# EAGLE design Beta (EAGLE 9.6.2)
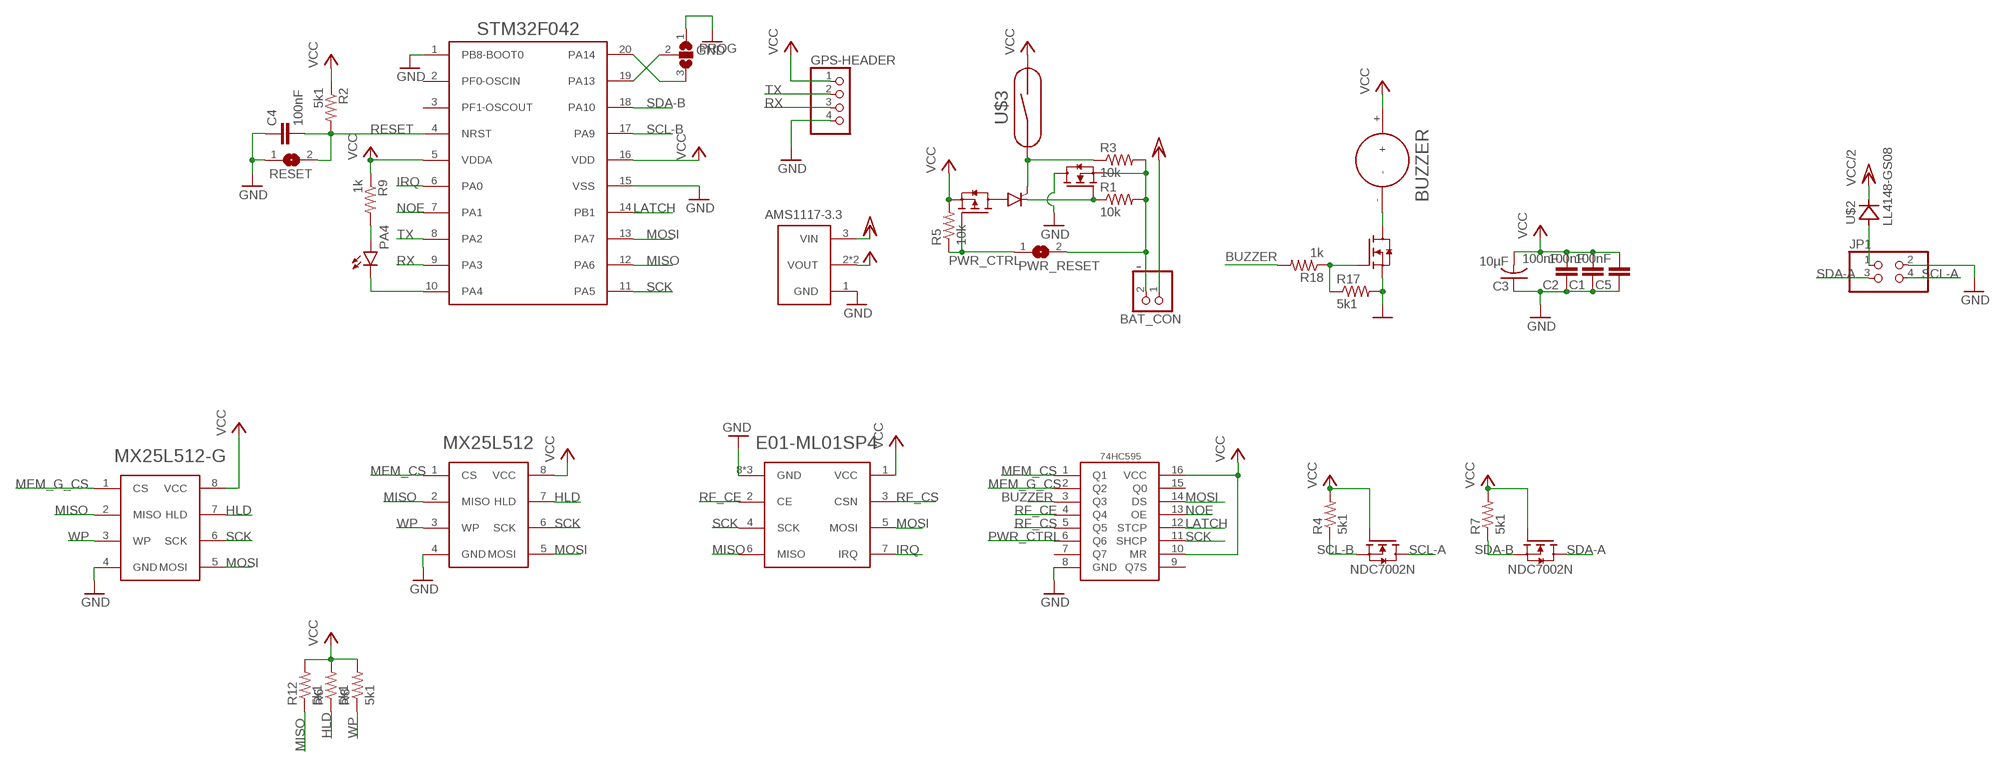
[diagram p0: schematic, sheet 1]

## Parts
74HC595  74HC595SOIC16  [SOIC16]
AMS1117-3.3  AMS1117  [SOT223]
AO3407  AO3407A  [SOT23-3]
BAT_CON  PINHD-1X2  [1X02]
BUZ  SI2302CDS  [SOT23-3]
BUZZER  BUZZER-5V  [BUZZER]
C1  100nF  C-EUC0603  [C0603]
C2  100nF  C-EUC0603  [C0603]
C3  10µF  C-USC1206  [C1206]
C4  100nF  C-EUC0603  [C0603]
C5  100nF  C-EUC0603  [C0603]
E01-ML01SP4  E01-ML01SP4  [E01-ML01SP4]
GPS-HEADER  PINHD-1X4  [1X04]
JP1  PINHD-2X2  [2X02]
MX25L512  MX25L25645  [SOP8]
MX25L512-G  MX25L25645  [SOP8]
NDC7002N  NDC7002N  [SOT-23-6]
P0102BL  P0102BL  [SOT23-3]
PA4  LEDCHIPLED_0603  [CHIPLED_0603]
PROG  SJ2W  [SJ_2]
PWR_RESET  SJ  [SJ]
R1  10k  R-US_R0603  [R0603]
R2  5k1  R-US_R0603  [R0603]
R3  10k  R-US_R0603  [R0603]
R4  5k1  R-US_R0603  [R0603]
R5  10k  R-US_R0603  [R0603]
R6  5k1  R-US_R0603  [R0603]
R7  5k1  R-US_R0603  [R0603]
R8  5k1  R-US_R0603  [R0603]
R9  1k  R-US_R0603  [R0603]
R12  5k1  R-US_R0603  [R0603]
R17  5k1  R-US_R0603  [R0603]
R18  1k  R-US_R0603  [R0603]
RESET  SJ  [SJ]
SI2302  SI2302CDS  [SOT23-3]
STM32F042  STM32F042F6P6  [TSSOP-20]
U$2  LL4148-GS08  [SOD-80]
U$3  МКА-07101  [МКА-07101]

## Nets
BUZZER: 74HC595.3(Q3) R18.2
GND: 74HC595.8(GND) AMS1117-3.3.1(GND) BUZ.2(S) C1.1 C2.1 C3.1 C4.1 C5.1 E01-ML01SP4.8(GND) E01-ML01SP4.9(GND) E01-ML01SP4.10(GND) GPS-HEADER.4 JP1.2 MX25L512-G.4(GND) MX25L512.4(GND) PROG.1 R17.2 RESET.1 SI2302.3(D) STM32F042.1(PB8-BOOT0) STM32F042.15(VSS)
GND1: PA4.C STM32F042.10(PA4)
HLD: MX25L512-G.7(HLD) MX25L512.7(HLD) R6.1
IRQ: E01-ML01SP4.7(IRQ) STM32F042.6(PA0)
LATCH: 74HC595.12(STCP) STM32F042.14(PB1)
MEM_CS: 74HC595.1(Q1) MX25L512.1(CS)
MEM_G_CS: 74HC595.2(Q2) MX25L512-G.1(CS)
MISO: E01-ML01SP4.6(MISO) MX25L512-G.2(MISO) MX25L512.2(MISO) R12.1 STM32F042.12(PA6)
MOSI: 74HC595.14(DS) E01-ML01SP4.5(MOSI) MX25L512-G.5(MOSI) MX25L512.5(MOSI) STM32F042.13(PA7)
N$1: BUZ.3(D) BUZZER.-
N$2: PROG.2 STM32F042.19(PA13)
N$3: PROG.3 STM32F042.20(PA14)
N$4: P0102BL.1(C) R1.1 SI2302.1(G)
N$5: PA4.A R9.2
N$6: P0102BL.2(G) R3.1 U$3.1
N$7: AO3407.3(D) P0102BL.3(A)
N$8: BAT_CON.2 PWR_RESET.2 R1.2 R3.2 SI2302.2(S)
N$9: BUZ.1(G) R17.1 R18.1
N$16: JP1.1 U$2.1(A)
NOE: 74HC595.13(OE) STM32F042.7(PA1)
PWR_CTRL: 74HC595.6(Q6) AO3407.1(G) PWR_RESET.1 R5.1
RESET: C4.2 R2.2 RESET.2 STM32F042.4(NRST)
RF_CE: 74HC595.4(Q4) E01-ML01SP4.2(CE)
RF_CS: 74HC595.5(Q5) E01-ML01SP4.3(CSN)
RX: GPS-HEADER.3 STM32F042.9(PA3)
SCK: 74HC595.11(SHCP) E01-ML01SP4.4(SCK) MX25L512-G.6(SCK) MX25L512.6(SCK) STM32F042.11(PA5)
SCL-A: JP1.4 NDC7002N.6(D1)
SCL-B: NDC7002N.5(S1) R4.1 STM32F042.17(PA9)
SDA-A: JP1.3 NDC7002N.4(D2)
SDA-B: NDC7002N.2(S2) R7.1 STM32F042.18(PA10)
TX: GPS-HEADER.2 STM32F042.8(PA2)
VCC: 74HC595.10(MR) 74HC595.16(VCC) AMS1117-3.3.2(VOUT) AMS1117-3.3.4(VOUT) AO3407.2(S) BUZZER.+ C1.2 C2.2 C3.2 C5.2 E01-ML01SP4.1(VCC) GPS-HEADER.1 MX25L512-G.8(VCC) MX25L512.8(VCC) NDC7002N.1(G1) NDC7002N.3(G2) R2.1 R4.2 R5.2 R6.2 R7.2 R8.2 R9.1 R12.2 STM32F042.5(VDDA) STM32F042.16(VDD) U$3.2
VCC/2: AMS1117-3.3.3(VIN) BAT_CON.1 U$2.2(C)
WP: MX25L512-G.3(WP) MX25L512.3(WP) R8.1
Unconnected: 74HC595.7(Q7) 74HC595.9(Q7S) 74HC595.15(Q0) STM32F042.2(PF0-OSCIN) STM32F042.3(PF1-OSCOUT)

## Notes on the sheet
- -

## Library data of the parts
74HC595 = CanCubeSat:74HC595
AMS1117-3.3 = Kunosheru:AMS1117
AO3407 = CanCubeSat:AO3407A
BAT_CON = pinhead:PINHD-1X2: PIN HEADER
BUZ SI2302 = CanCubeSat:SI2302CDS
BUZZER = CanCubeSat:BUZZER-5V
C1 C2 C4 C5 = rcl:C-EU: CAPACITOR, European symbol; SPICEPREFIX: C
C3 = rcl:C-US: CAPACITOR, American symbol; SPICEPREFIX: C
E01-ML01SP4 = CanCubeSat:E01-ML01SP4
GPS-HEADER = HM:PINHD-1X4: PIN HEADER
JP1 = pinhead:PINHD-2X2: PIN HEADER
MX25L512 MX25L512-G = HM:MX25L25645
NDC7002N = HM:NDC7002N
P0102BL = Kunosheru:P0102BL
PA4 = led:LED: LED OSRAM: - CHIPLED LG R971, LG N971, LY N971, LG Q971, LY Q971, LO R971, LY R971 LH N974, LH R974 LS Q976, LO Q976, LY Q976 LO Q996 - Hyper CHIPLED LW Q18S LB Q993, LB Q99A, LB R99A - SideLED LS A670, LO A670, LY A670, LG A670, LP A670 LB A673, LV A673, LT A673, LW A673 LH A674 LY A675 LS A676, LA A676, LO A676, LY A676, LW A676 LS A679, LY A679, LG A679 - Hyper Micro SIDELED® LS Y876, LA Y876, LO Y876, LY Y876 LT Y87S - SmartLED LW L88C, LW L88S LB L89C, LB L89S, LG L890 LS L89K, LO L89K, LY L89K LS L896, LA L896, LO L896, LY L896 - TOPLED LS T670, LO T670, LY T670, LG T670, LP T670 LSG T670, LSP T670, LSY T670, LOP T670, LYG T670 LG T671, LOG T671, LSG T671 LB T673, LV T673, LT T673, LW T673 LH T674 LS T676, LA T676, LO T676, LY T676, LB T676, LH T676, LSB T676, LW T676 LB T67C, LV T67C, LT T67C, LS T67K, LO T67K, LY T67K, LW E67C LS E67B, LA E67B, LO E67B, LY E67B, LB E67C, LV E67C, LT E67C LW T67C LS T679, LY T679, LG T679 LS T770, LO T770, LY T770, LG T770, LP T770 LB T773, LV T773, LT T773, LW T773 LH T774 LS E675, LA E675, LY E675, LS T675 LS T776, LA T776, LO T776, LY T776, LB T776 LHGB T686 LT T68C, LB T68C - Hyper Mini TOPLED® LB M676 - Mini TOPLED Santana® LG M470 LS M47K, LO M47K, LY M47K Source: http://www.osram.convergy.de LUXEON: - LUMILED® LXK2-PW12-R00, LXK2-PW12-S00, LXK2-PW14-U00, LXK2-PW14-V00 LXK2-PM12-R00, LXK2-PM12-S00, LXK2-PM14-U00 LXK2-PE12-Q00, LXK2-PE12-R00, LXK2-PE12-S00, LXK2-PE14-T00, LXK2-PE14-U00 LXK2-PB12-K00, LXK2-PB12-L00, LXK2-PB12-M00, LXK2-PB14-N00, LXK2-PB14-P00, LXK2-PB14-Q00 LXK2-PR12-L00, LXK2-PR12-M00, LXK2-PR14-Q00, LXK2-PR14-R00 LXK2-PD12-Q00, LXK2-PD12-R00, LXK2-PD12-S00 LXK2-PH12-R00, LXK2-PH12-S00 LXK2-PL12-P00, LXK2-PL12-Q00, LXK2-PL12-R00 Source: www.luxeon.com KINGBRIGHT: KA-3528ASYC Source: www.kingbright.com
PROG = jumper:SJ2W: SMD solder JUMPER
PWR_RESET RESET = jumper:SJ: SMD solder JUMPER
R1-R9 R12 R17 R18 = rcl:R-US_: RESISTOR, American symbol; SPICEPREFIX: R
STM32F042 = Kunosheru:STM32F042F6P6
U$2 = CanCubeSat:LL4148-GS08
U$3 = Kunosheru:МКА-07101

## Board
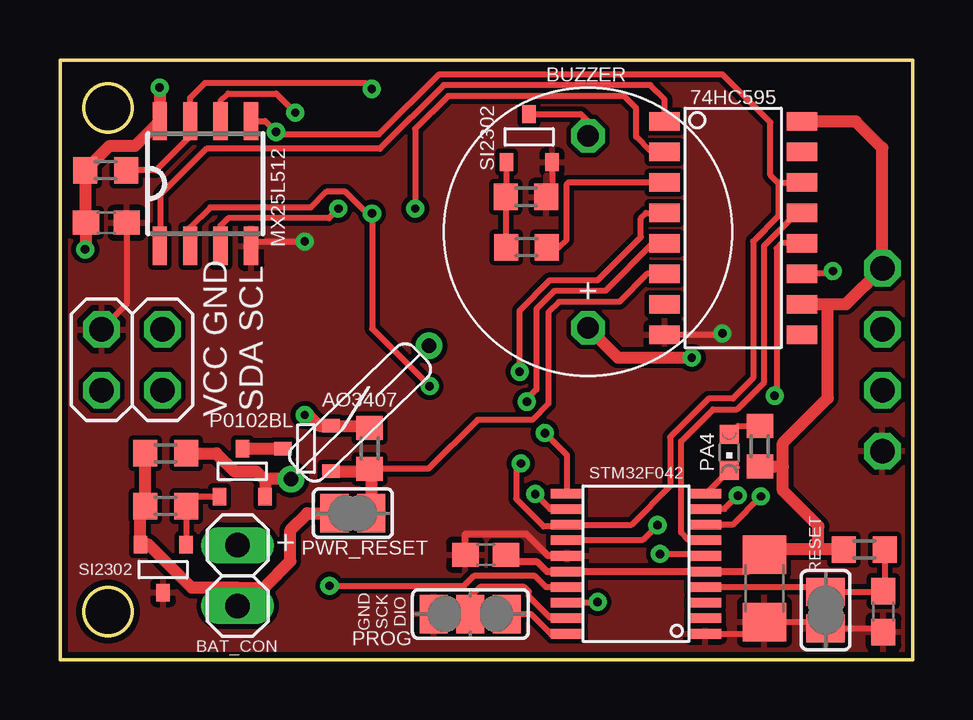
[diagram p1: board, top side]
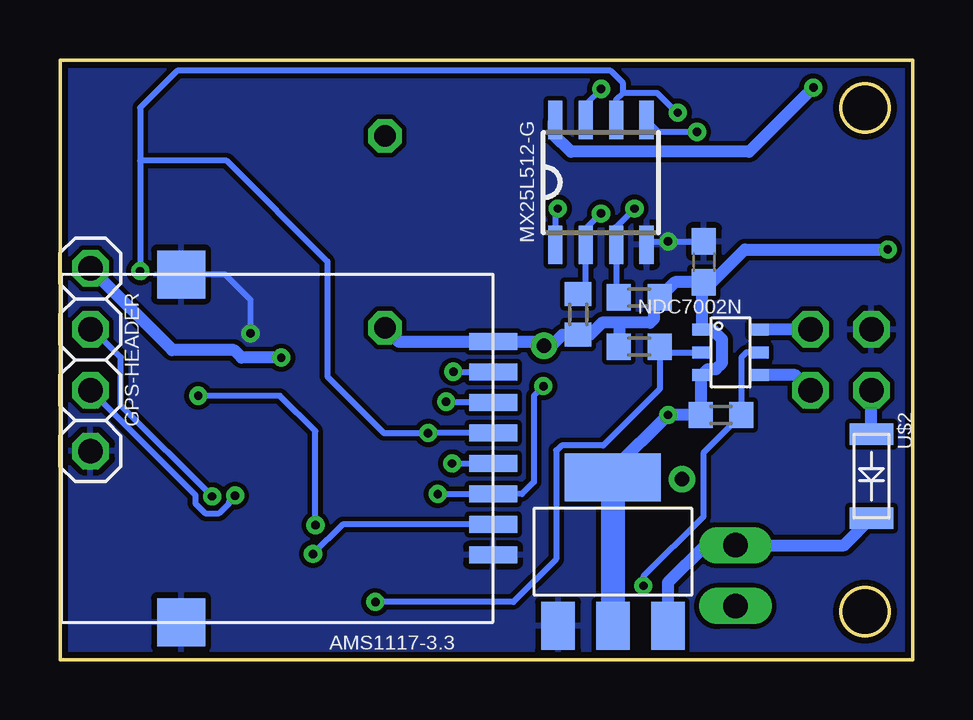
[diagram p2: board, bottom side, seen from below]

Size 35.54 x 25 mm. Coordinates in mm from the lower left corner, seen from the top.
Outline: 0,0 35.54,0 35.54,25 0,25 0,0
Outline: circle at 2,2 radius 1
Outline: circle at 2,23 radius 1
Copper layers (1*16): Top 0.035mm / dielectric 1.5mm / Bottom 0.035mm
Design rules "rezonit": minimum track width 0.25mm, minimum drill 0.35mm, track to track 0.2mm, track to pad 0.2mm, pad to pad 0.15mm, via to via 0.2mm, smd to smd 0.2mm, copper to edge 0.25mm, drill to drill 0.25mm, minimum pad ring 10mil, minimum via ring 8mil, stop-mask expansion 4mil, vias tented up to drill 0mil, thermal gap 10mil

### Footprints (pad centres in the part's own frame; a part is rotated, then mirrored left to right if it is on the bottom)
SOIC16 = smd 1.27 x 0.76: 1 -2.86,4.445; 2 -2.86,3.175; 3 -2.86,1.905; 4 -2.86,0.635; 5 -2.86,-0.635; 6 -2.86,-1.905; 7 -2.86,-3.175; 8 -2.86,-4.445; 9 2.86,-4.445; 10 2.86,-3.175; 11 2.86,-1.905; 12 2.86,-0.635; 13 2.86,0.635; 14 2.86,1.905; 15 2.86,3.175; 16 2.86,4.445
SOT223 = smd 1.4 x 2: 1 -2.29,-3.1; 2 0,-3.1; 3 2.29,-3.1 | smd 4 x 2: 4 0,3.1
SOT23-3 = smd 0.56 x 0.73: 1 -0.95,-1; 2 0.95,-1; 3 0,1
1X02 = drill 1.016 long: 1 -1.27,0; 2 1.27,0
BUZZER = drill 0.9 octagon: + 0,-4; - 0,4
C0603 = smd 1.1 x 1: 1 -0.85,0; 2 0.85,0
C1206 = smd 1.6 x 1.8: 1 -1.4,0; 2 1.4,0
E01-ML01SP4 = smd 0.7 x 2: 1 -4.445,9; 2 -3.175,9; 3 -1.905,9; 4 -0.635,9; 5 0.635,9; 6 1.905,9; 7 3.175,9; 8 4.445,9 | smd 2 x 2: 9 7.25,-4; 10 -7.25,-4
1X04 = drill 1.016 octagon: 1 -3.81,0; 2 -1.27,0; 3 1.27,0; 4 3.81,0
2X02 = drill 1.016 octagon: 1 -1.27,-1.27; 2 -1.27,1.27; 3 1.27,-1.27; 4 1.27,1.27
SOP8 = smd 0.6 x 1.6: 1 -1.905,-2.6; 2 -0.635,-2.6; 3 0.635,-2.6; 4 1.905,-2.6; 5 1.905,2.6; 6 0.635,2.6; 7 -0.635,2.6; 8 -1.905,2.6
SOT-23-6 = smd 0.5 x 0.8: 1 -0.95,-1.2; 2 0,-1.2; 3 0.95,-1.2; 4 0.95,1.2; 5 0,1.2; 6 -0.95,1.2
CHIPLED_0603 = smd 0.8 x 0.8: A 0,-0.75; C 0,0.75
SJ_2 = smd 1.168 x 1.6: 1 -1.524,0; 2 0,0; 3 1.524,0
SJ = smd 1.168 x 1.6: 1 -0.762,0; 2 0.762,0
R0603 = smd 1 x 1.1: 1 -0.85,0; 2 0.85,0
TSSOP-20 = smd 0.4 x 1.35: 1 -2.925,-2.875; 2 -2.275,-2.875; 3 -1.625,-2.875; 4 -0.975,-2.875; 5 -0.325,-2.875; 6 0.325,-2.875; 7 0.975,-2.875; 8 1.625,-2.875; 9 2.275,-2.875; 10 2.925,-2.875; 11 2.925,2.875; 12 2.275,2.875; 13 1.625,2.875; 14 0.975,2.875; 15 0.325,2.875; 16 -0.325,2.875; 17 -0.975,2.875; 18 -1.625,2.875; 19 -2.275,2.875; 20 -2.925,2.875
SOD-80 = smd 0.9 x 1.8: 1 -1.75,0; 2 1.75,0
МКА-07101 = drill 0.6: 1 -4,0; 2 4,0

### Placement (x,y rotation side)
74HC595  28.05,17.99 0 top
AMS1117-3.3  12.5,4.5 0 bottom
AO3407  10.3,8.8 90 top
BAT_CON  7.4,3.5 270 top
BUZ  19.55,21.74 0 top
BUZZER  22,17.83 0 top
C1  17.74,4.37 0 top
C2  1.93,18.21 180 top
C3  29.35,2.97 90 top
C4  34.31,2 90 top
C5  8.71,16.58 270 bottom
E01-ML01SP4  26.49,8.81 270 bottom
GPS-HEADER  34.27,12.5 270 bottom
JP1  3,12.5 0 top
MX25L512  6.06,19.85 0 top
MX25L512-G  13,19.9 0 bottom
NDC7002N  7.6,12.81 270 bottom
P0102BL  7.6,7.8 0 top
PA4  27.88,8.63 180 top
PROG  17.1,1.9 0 top
PWR_RESET  12.2,6.1 180 top
R1  4.4,6.4 180 top
R2  33.51,4.59 0 top
R3  4.4,8.6 180 top
R4  8,10.2 180 bottom
R5  12.9,8.8 90 top
R6  1.9,20.4 180 top
R7  11.4,13.05 180 bottom
R8  11.4,15.1 0 bottom
R9  29.16,8.9 90 top
R12  13.95,14.4 270 bottom
R17  19.42,19.29 0 top
R18  19.44,17.19 0 top
RESET  31.9,2.06 90 top
SI2302  4.3,3.8 180 top
STM32F042  24,4 90 top
U$2  1.73,7.65 270 bottom
U$3  12.5,10.3 44 top

### Tracks (layer width: path | path; a pad name or v marks a point on that pad's centre or on a via)
BUZZER
  Top 0.25: 74HC595.3 21.19,19.89 21.09,19.8 21.09,17.5 20.79,17.19 R18.2
GND  (via drill 0.35)
  Top 0.25: BUZ.2 20.5,19.52 R17.2 | STM32F042.1 28.86,1.07 C3.1 31.63,1.57 RESET.1 34.16,1.3 C4.1 | C2.1 2.78,14.82 JP1.2 | MX25L512.4 8.14,17.43 v10.2,17.43 | 74HC595.8 27.55,13.54 v27.6,13.6
  Top 0.3: STM32F042.15 20.34,4.33 19.45,5.22 16.89,5.22 C1.1
  Bottom 0.25: MX25L512-G.4 10.96,17.43 v10.2,17.43 C5.1 | v27.6,13.6 27.6,15 28.66,16.06 E01-ML01SP4.10
  pour Top: -1,-1 -1,26 38,26 38,-1
  pour Bottom: -1,26 37,26 37,-1 -1,-1
GND1
  Top 0.25: PA4.C 26.93,6.93 STM32F042.10
HLD  (via drill 0.35)
  Top 0.25: v12.99,23.79 12.73,24.05 6.05,24.05 5.42,23.43 MX25L512.7 5.4,22.43 5.4,21.8 4,20.4 R6.1
  Bottom 0.25: v12.99,23.79 13.63,23.15 MX25L512-G.7
IRQ  (via drill 0.35)
  Top 0.25: v25,4.4 26.8,4.4 STM32F042.6
  Bottom 0.25: v25,4.4 23.77,5.63 E01-ML01SP4.7
LATCH  (via drill 0.35)
  Top 0.25: STM32F042.14 21.15,4.95 21.2,5 24.29,5 v24.9,5.6 | 74HC595.12 30.07,17.36 29.86,17.14 29.86,11.08 v29.78,11
  Bottom 0.25: v29.78,11 26.38,11 24.9,9.52 v24.9,5.6
MEM_CS
  Top 0.25: 74HC595.1 25.19,23.36 24.6,23.95 15.98,23.95 13.33,21.3 6.1,21.3 4.2,19.4 4.2,17.3 MX25L512.1
MEM_G_CS  (via drill 0.35)
  Top 0.25: 74HC595.2 25.16,21.2 24.6,21.2 24,21.8 24,23 23.5,23.5 16.17,23.5 14.8,22.13 v14.8,18.8
  Bottom 0.25: v14.8,18.8 14.9,18.7 MX25L512-G.1
MISO  (via drill 0.35)
  Top 0.25: MX25L512.2 5.42,18.02 6.25,18.85 10.45,18.85 11.1,19.5 11.89,19.5 12.79,18.6 v13,18.6 13,13.8 v15.4,11.4 | STM32F042.12 20.43,6.28 v19.8,6.9
  Bottom 0.25: R12.1 13.63,15.56 MX25L512-G.2 13.63,17.96 v13,18.6 | v19.8,6.9 E01-ML01SP4.6 | E01-ML01SP4.6 | v15.4,11.4 15.8,11 15.8,7.4 16.3,6.9 E01-ML01SP4.6
MOSI  (via drill 0.35)
  Top 0.25: MX25L512.5 8.55,22.45 v9,22 9.1,21.9 13.29,21.9 15.79,24.4 27.6,24.4 29.6,22.4 29.6,20.2 29.95,19.85 | 29.95,19.85 29.95,18.51 28.88,17.43 28.88,11.73 28.03,10.88 27.03,10.88 25.43,9.28 25.43,7.23 23.82,5.62 STM32F042.13 21.05,5.55 20.16,5.55 19,6.71 19,7.97 v19.2,8.18 | 29.95,19.85 30,19.89 74HC595.14
  Bottom 0.25: v9,22 10.6,22 MX25L512-G.5 | v19.2,8.18 E01-ML01SP4.5
N$1
  Top 0.25: BUZ.3 21.69,22.74 22,22.43 BUZZER.-
N$2
  Top 0.25: STM32F042.19 20.44,1.73 19.53,2.63 19.53,2.83 19.34,3.02 17.5,3.02 17.11,2.63 17.11,1.92 PROG.2
N$3
  Top 0.25: STM32F042.20 21.1,1.05 20.46,1.05 19.61,1.9 PROG.3
N$4
  Top 0.25: P0102BL.1 5.65,6.8 R1.1 SI2302.1
N$5
  Top 0.25: PA4.A 28.25,9.75 R9.2
N$6
  Top 0.25: 8.55,7.47 8.6,7.52
  Top 0.5: U$3.1 8.6,7.52 | P0102BL.2 8.55,7.47 8.19,7.83 7.28,7.83 6.52,8.6 R3.1
N$7
  Top 0.5: P0102BL.3 AO3407.3
N$8
  Top 0.5: BAT_CON.2 7.4,3 | 7.4,3 5.48,3 3.68,4.8 SI2302.2 3.35,6.2 R1.2 R3.2 | PWR_RESET.2 10.3,6.1 9.6,5.4 9.6,4.09 8.51,3 7.4,3
N$9
  Top 0.25: BUZ.1 18.6,19.32 R17.1 18.57,17.21 R18.1
N$16
  Bottom 0.5: U$2.1 JP1.1
NOE
  Top 0.25: STM32F042.7 26.85,5 26.16,5 25.88,5.29 25.88,9.1 27.21,10.44 28.22,10.44 29.34,11.56 29.34,17.26 30.7,18.62 74HC595.13
PWR_CTRL
  Top 0.25: 12.8,7.85 R5.1 15.35,7.95 17.4,10 19.69,10 20.35,10.66 20.35,14.48 20.79,14.91 23.3,14.91 24.47,16.09 74HC595.6
  Top 0.5: R5.1 12.96,7.89 PWR_RESET.1 | AO3407.1 12.8,7.85
RESET
  Top 0.25: STM32F042.4 31.7,3.02 RESET.2 34.28,2.82 C4.2 34.36,2.9 R2.2
RF_CE  (via drill 0.35)
  Top 0.25: v19.15,12 19.15,14.55 20.41,15.81 22.4,15.81 24.2,17.61 24.2,18.4 24.43,18.62 74HC595.4
  Bottom 0.25: v19.15,12 17.5,12 E01-ML01SP4.2
RF_CS  (via drill 0.35)
  Top 0.25: v19.45,10.75 19.45,10.86 19.85,11.26 19.85,14.62 20.6,15.37 22.71,15.37 24.7,17.36 74HC595.5
  Bottom 0.25: v19.45,10.75 17.52,10.75 E01-ML01SP4.3
RX  (via drill 0.35)
  Top 0.25: v28.24,6.84 27.68,6.28 STM32F042.9
  Bottom 0.25: v28.24,6.84 28.5,6.58 28.5,6.51 28.91,6.1 29.49,6.1 29.9,6.51 29.9,6.86 GPS-HEADER.3
SCK  (via drill 0.35)
  Top 0.25: MX25L512.6 6.7,23.3 7,23.6 9,23.6 v9.8,22.8 | v32.2,16.2 32.09,16.09 74HC595.11 | STM32F042.11 21.12,8.52 v20.2,9.45
  Bottom 0.25: v9.8,22.8 9.84,22.8 10.66,23.62 12.07,23.62 | 12.07,23.62 12.07,24.02 12.6,24.55 30.66,24.55 32.2,23.01 32.2,20.8 | 32.2,20.8 v32.2,16.2 | E01-ML01SP4.4 v20.2,9.45 22.05,9.45 24.4,11.8 24.4,16.6 28.6,20.8 32.2,20.8 | MX25L512-G.6 12.37,23.34 12.07,23.62
SCL-A
  Bottom 0.5: JP1.4 NDC7002N.6
SCL-B  (via drill 0.35)
  Top 0.25: v11.23,3.07 16.83,3.07 17.24,3.48 19.78,3.48 20.24,3.02 STM32F042.17
  Bottom 0.25: NDC7002N.5 6.94,12.81 7.15,12.6 R4.1 8.74,8.61 8.74,5.96 11.23,3.46 v11.23,3.07
SDA-A
  Bottom 0.5: JP1.3 4.9,11.86 NDC7002N.4
SDA-B  (via drill 0.35)
  Top 0.25: v22.4,2.4 22.38,2.38 STM32F042.18
  Bottom 0.25: NDC7002N.2 10.31,12.81 R7.1 10.55,11.29 12.91,8.93 14.63,8.93 14.82,8.73 14.87,8.73 14.87,4.18 16.64,2.4 v22.4,2.4
TX  (via drill 0.35)
  Top 0.25: v29.2,6.8 28.02,5.62 STM32F042.8
  Bottom 0.25: v29.2,6.8 33,10.6 33,12.6 34.17,13.77 GPS-HEADER.2
VCC  (via drill 0.35)
  Top 0.25: 4.05,22.35 MX25L512.8 | 29.19,4.21 C3.2 | 26.2,12.59 v26.32,12.59
  Top 0.3: C1.2 18.89,4.07 19.89,4.07 20.28,3.67 STM32F042.16 24.59,3.67 24.6,3.67 25.2,3.67 STM32F042.5 28.66,3.67 29.19,4.21
  Top 0.5: v1.05,17.1 1.08,17.13 C2.2 1.05,18.24 R6.2 2.07,21.42 3.13,21.42 4.05,22.35 | v4.15,23.85 MX25L512.8 | v10.2,10.2 10.35,10.2 10.8,9.75 AO3407.2 12.8,9.75 R5.2 | BUZZER.+ 23.24,12.59 26.2,12.59 | 74HC595.16 33.16,22.43 34.27,21.33 GPS-HEADER.1 34.24,16.31 32.74,14.81 32,14.81 | 74HC595.10 32,14.81 | R9.1 30.12,8.05 | 30.12,8.05 30.12,7.05 31.61,5.56 31.6,5.55 31.6,4.59 | 30.12,8.05 30.12,9.03 32,10.9 32,14.81 | R2.1 31.6,4.59 | 31.6,4.59 29.57,4.59 C3.2
  Bottom 0.25: 8.3,13.7 8.36,13.76
  Bottom 0.5: MX25L512-G.8 14.98,22.42 14.98,21.91 14.24,21.17 6.83,21.17 v4.15,23.85 | BUZZER.+ 21.43,13.26 E01-ML01SP4.1 15.55,13.26 U$3.2 15.07,13.08 14.6,13.55 R12.2 13.45,13.55 12.95,14.05 12.2,14.05 | R7.2 12.24,13.05 12.24,14.01 12.2,14.05 | 12.2,14.05 10.95,14.05 10.8,14.2 10.8,14.85 R8.2 9.92,15.73 C5.2 | C5.2 8.8,15.64 NDC7002N.1 8.36,13.76 | C5.2 8.37,15.73 7,17.1 v1.05,17.1 | 8.3,13.7 7.95,13.35 7.95,12.37 8.21,12.11 8.55,12.11 NDC7002N.3 8.85,11.81 R4.2 v10.2,10.2 12.5,7.9 AMS1117-3.3.4 | v26.32,12.59 27.97,12.59 28.29,12.9 30.86,12.9 GPS-HEADER.1
  Bottom 1: AMS1117-3.3.4 AMS1117-3.3.2
VCC/2
  Bottom 0.25: 10.21,1.6 AMS1117-3.3.3
  Bottom 0.5: 10.21,1.6 10.21,3.2 8.64,4.77 BAT_CON.1 2.86,4.77 U$2.2
WP  (via drill 0.35)
  Top 0.25: MX25L512.3 6.7,18.09 7,18.4 11.2,18.4 v11.6,18.8
  Bottom 0.25: R8.1 12.37,15.21 MX25L512-G.3 12.37,18.04 v11.6,18.8

### Text on the board
tNames: SI2302 | + | VCC GND / SDA SCL | + | GND / SCK / DIO